# Altium schematic sheet INTERFACE.SchDoc
size B; SheetNumber: 8; SheetTotal: 8
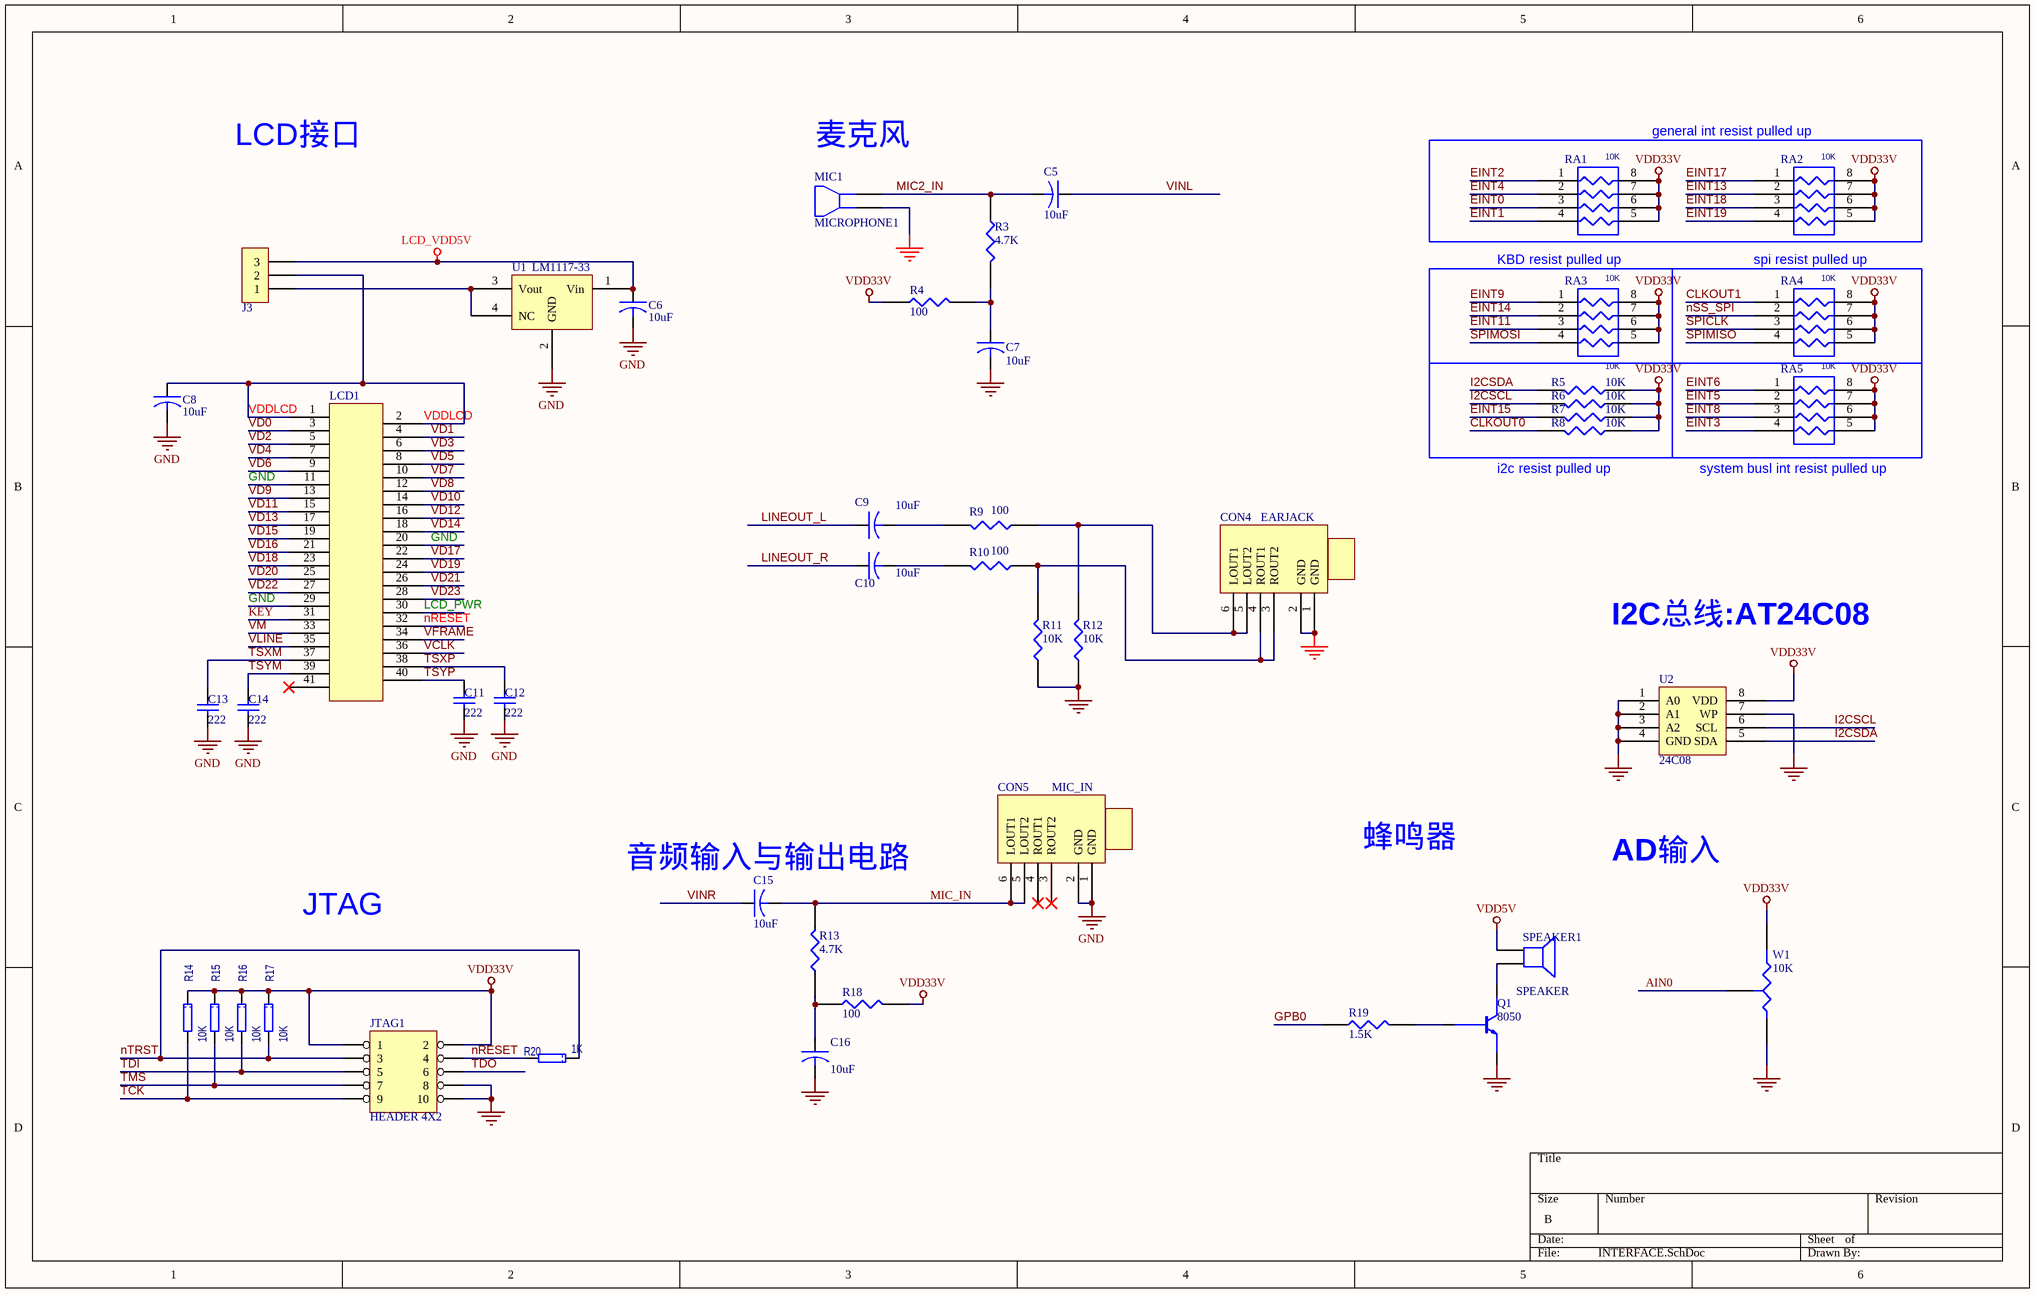
[diagram p0: INTERFACE.SchDoc]

## Parts
C5  10uF  [0805C]
C6  10uF  [3216A]
C7  10uF  [0805C]
C8  10uF  [3216A]
C9  10uF  [0805C]
C10  10uF  [0805C]
C11  222  [0603A]
C12  222  [0603A]
C13  222  [0603A]
C14  222  [0603A]
C15  10uF  [0805C]
C16  10uF  [0805C]
CON4  EARJACK  [MIN_PHONE]
CON5  MIC_IN  [MIN_PHONE]
J3  J3  [SIP3S]  (value not drawn)
JTAG1  HEADER 4X2  [IDC10S]
LCD1  LCD41P  [LCD-40]  (value not drawn)
MIC1  MICROPHONE1  [MIC2]
Q1  8050  [SOT23]
R3  4.7K  [0603R]
R4  100  [0603R]
R5  10K  [0603R]
R6  10K  [0603R]
R7  10K  [0603R]
R8  10K  [0603R]
R9  100  [0603R]
R10  100  [0603R]
R11  10K  [0603R]
R12  10K  [0603R]
R13  4.7K  [0603R]
R14  10K  [0603R]
R15  10K  [0603R]
R16  10K  [0603R]
R17  10K  [0603R]
R18  100  [0603R]
R19  1.5K  [0603R]
R20  1K  [0603R]
RA1  10K  [R-AR4]  (value not drawn)
RA2  10K  [R-AR4]  (value not drawn)
RA3  10K  [R-AR4]  (value not drawn)
RA4  10K  [R-AR4]  (value not drawn)
RA5  10K  [R-AR4]  (value not drawn)
SPEAKER1  SPEAKER  [SPEAKER-9]
U1  LM1117-33  [TO-252]
U2  24C08  [SOP8-50-160]
W1  10K  [R_ADJ7]

## Blocks framed on the sheet
general int resist pulled up: RA1 RA2

## Nets
GND: C6.2 C7.2 C8.2 C11.1 C12.1 C13.1 C14.1 C16.2 CON4.1(GND) CON4.2(GND) CON5.1(GND) CON5.2(GND) JTAG1.8 JTAG1.10 LCD1.11 LCD1.20 LCD1.29 MIC1.2 Q1.E R11.1 R12.1 U1.2(GND) U2.1(A0) U2.2(A1) U2.3(A2) U2.4(GND) U2.7(WP) W1.1(A)
LCD_VDD5V: C6.1 J3.3 U1.1(Vin)
VDD5V: SPEAKER1.1
VDD33V: JTAG1.1 JTAG1.2 R4.2 R5.1 R6.1 R7.1 R8.1 R14.1 R15.1 R16.1 R17.1 R18.2 RA1.5(R4) RA1.6(R3) RA1.7(R2) RA1.8(R1) RA2.5(R4) RA2.6(R3) RA2.7(R2) RA2.8(R1) RA3.5(R4) RA3.6(R3) RA3.7(R2) RA3.8(R1) RA4.5(R4) RA4.6(R3) RA4.7(R2) RA4.8(R1) RA5.5(R4) RA5.6(R3) RA5.7(R2) RA5.8(R1) U2.8(VDD) W1.2(B)
AIN0: W1.3(TAP)
CLKOUT0: R8.2
CLKOUT1: RA4.1(R1)
EINT0: RA1.3(R3)
EINT1: RA1.4(R4)
EINT2: RA1.1(R1)
EINT3: RA5.4(R4)
EINT4: RA1.2(R2)
EINT5: RA5.2(R2)
EINT6: RA5.1(R1)
EINT8: RA5.3(R3)
EINT9: RA3.1(R1)
EINT11: RA3.3(R3)
EINT13: RA2.2(R2)
EINT14: RA3.2(R2)
EINT15: R7.2
EINT17: RA2.1(R1)
EINT18: RA2.3(R3)
EINT19: RA2.4(R4)
GPB0: R19.1
I2CSCL: R6.2 U2.6(SCL)
I2CSDA: R5.2 U2.5(SDA)
KEY: LCD1.31
LCD_PWR: LCD1.30
LINEOUT_L: C9.1
LINEOUT_R: C10.1
MIC2_IN: C5.2 MIC1.1 R3.2
MIC_IN: C15.2 CON5.5(LOUT2) CON5.6(LOUT1) R13.2
nRESET: JTAG1.4 LCD1.32 R20.2
nSS_SPI: RA4.2(R2)
nTRST: JTAG1.3 R17.2 R20.1
SPICLK: RA4.3(R3)
SPIMISO: RA4.4(R4)
SPIMOSI: RA3.4(R4)
TCK: JTAG1.9 R14.2
TDI: JTAG1.5 R16.2
TDO: JTAG1.6
TMS: JTAG1.7 R15.2
TSXM: C13.2 LCD1.37
TSXP: C12.2 LCD1.38
TSYM: C14.2 LCD1.39
TSYP: C11.2 LCD1.40
VCLK: LCD1.36
VD0: LCD1.3
VD1: LCD1.4
VD2: LCD1.5
VD3: LCD1.6
VD4: LCD1.7
VD5: LCD1.8
VD6: LCD1.9
VD7: LCD1.10
VD8: LCD1.12
VD9: LCD1.13
VD10: LCD1.14
VD11: LCD1.15
VD12: LCD1.16
VD13: LCD1.17
VD14: LCD1.18
VD15: LCD1.19
VD16: LCD1.21
VD17: LCD1.22
VD18: LCD1.23
VD19: LCD1.24
VD20: LCD1.25
VD21: LCD1.26
VD22: LCD1.27
VD23: LCD1.28
VDDLCD: C8.1 J3.2 LCD1.1 LCD1.2
VFRAME: LCD1.34
VINL: C5.1
VINR: C15.1
VLINE: LCD1.35
VM: LCD1.33
NetC7_1: C7.1 R3.1 R4.1
NetC9_2: C9.2 R9.2
NetC10_2: C10.2 R10.2
NetC16_1: C16.1 R13.1 R18.1
NetCON4_3: CON4.3(ROUT2) CON4.4(ROUT1) R10.1 R11.2
NetCON4_5: CON4.5(LOUT2) CON4.6(LOUT1) R9.1 R12.2
NetJ3_1: J3.1 U1.3(Vout) U1.4(NC)
NetQ1_B: Q1.B R19.2
NetQ1_C: Q1.C SPEAKER1.2

Not connected (* = marked no-connect by the designer): CON5 3(ROUT2)* 4(ROUT1)*; LCD1 41*

## Notes on the sheet
- LCD接口
- (near MIC1) 麦克风
- (near RA1) 10K
- (near RA2) 10K
- KBD resist pulled up
- (near RA3) 10K
- spi resist pulled up
- (near RA4) 10K
- 10K
- i2c resist pulled up
- (near RA5) system busl int resist pulled up
- I2C总线:AT24C08
- (near C15) 音频输入与输出电路
- 蜂鸣器
- AD输入
- JTAG

## Library data of the parts
C5-C10 C15 C16 = CAPACITOR
C11-C14 = Cap: Capacitor; Published: 8-Jun-2000; LatestRevisionDate: 17-Jul-2002; LatestRevisionNote: Re-released for DXP Platform.; PackageReference: RAD-0.3; Publisher: Altium Limited; Value: 222
CON5 = EARJACK
J3 = CON3: Connector
JTAG1 = HEADER 5X2
MIC1 = MICROPHONE1: Microphone
Q1 = NPN
R3-R13 R18 R19 = RES1
R14-R17 R20 = RES
RA1-RA5 = RP4R: Text Field1: 30; Text Field2: 50
U2 = AT24LC04: U
W1 = RESISTOR TAPPED